# EAGLE schematic FAR (EAGLE 9.6.2)
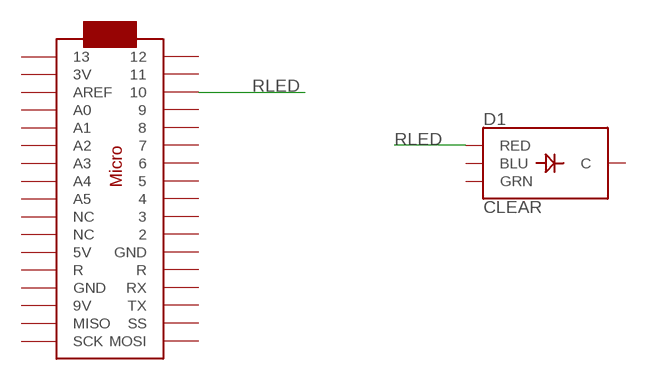
[diagram p0: schematic, sheet 1]

## Parts
D1  CLEAR  LED-RGB-CCCLEAR  [LED-RGB-THRU]
U$1  ARDUINOMICRO  [ARDUINOMICRO]

## Nets
RLED: D1.1(RED) U$1.P$3
Unconnected: D1.2(C) D1.3(GRN) D1.4(BLU) U$1.P$1 U$1.P$2 U$1.P$4 U$1.P$5 U$1.P$6 U$1.P$7 U$1.P$8 U$1.P$9 U$1.P$10 U$1.P$11 U$1.P$12(GND) U$1.P$13(R) U$1.P$14(RX) U$1.P$15(TX) U$1.P$16(SS) U$1.P$17(MOSI) U$1.P$18(SCK) U$1.P$19(MISO) U$1.P$20(9V) U$1.P$21(GND) U$1.P$22(R) U$1.P$23(5V) U$1.P$24(NC) U$1.P$25(NC) U$1.P$26(A5) U$1.P$27(A4) U$1.P$28(A3) U$1.P$29(A2) U$1.P$30(A1) U$1.P$31(A0) U$1.P$32(AREF) U$1.P$33(3V) U$1.P$34

## Library data of the parts
D1 = SparkFun-LED:LED-RGB-CC: LED-RGB Common Cathode Packages: LED RGB-THRU LED_PIRANHA_5MM SparkFun Products: RGB Diffused Common Cathode- Diffuse <[https://www.sparkfun.com/products/9264]> RGB Diffused Common Cathode - Clear <[https://www.sparkfun.com/products/105]> LED-RGB 5mm Square (Piranha) <[https://www.sparkfun.com/products/11679]>; PROD_ID: DIO-08418
U$1 = adafruit:ARDUINOMICRO